# Altium schematic sheet [3]Motor.SchDoc
size A3
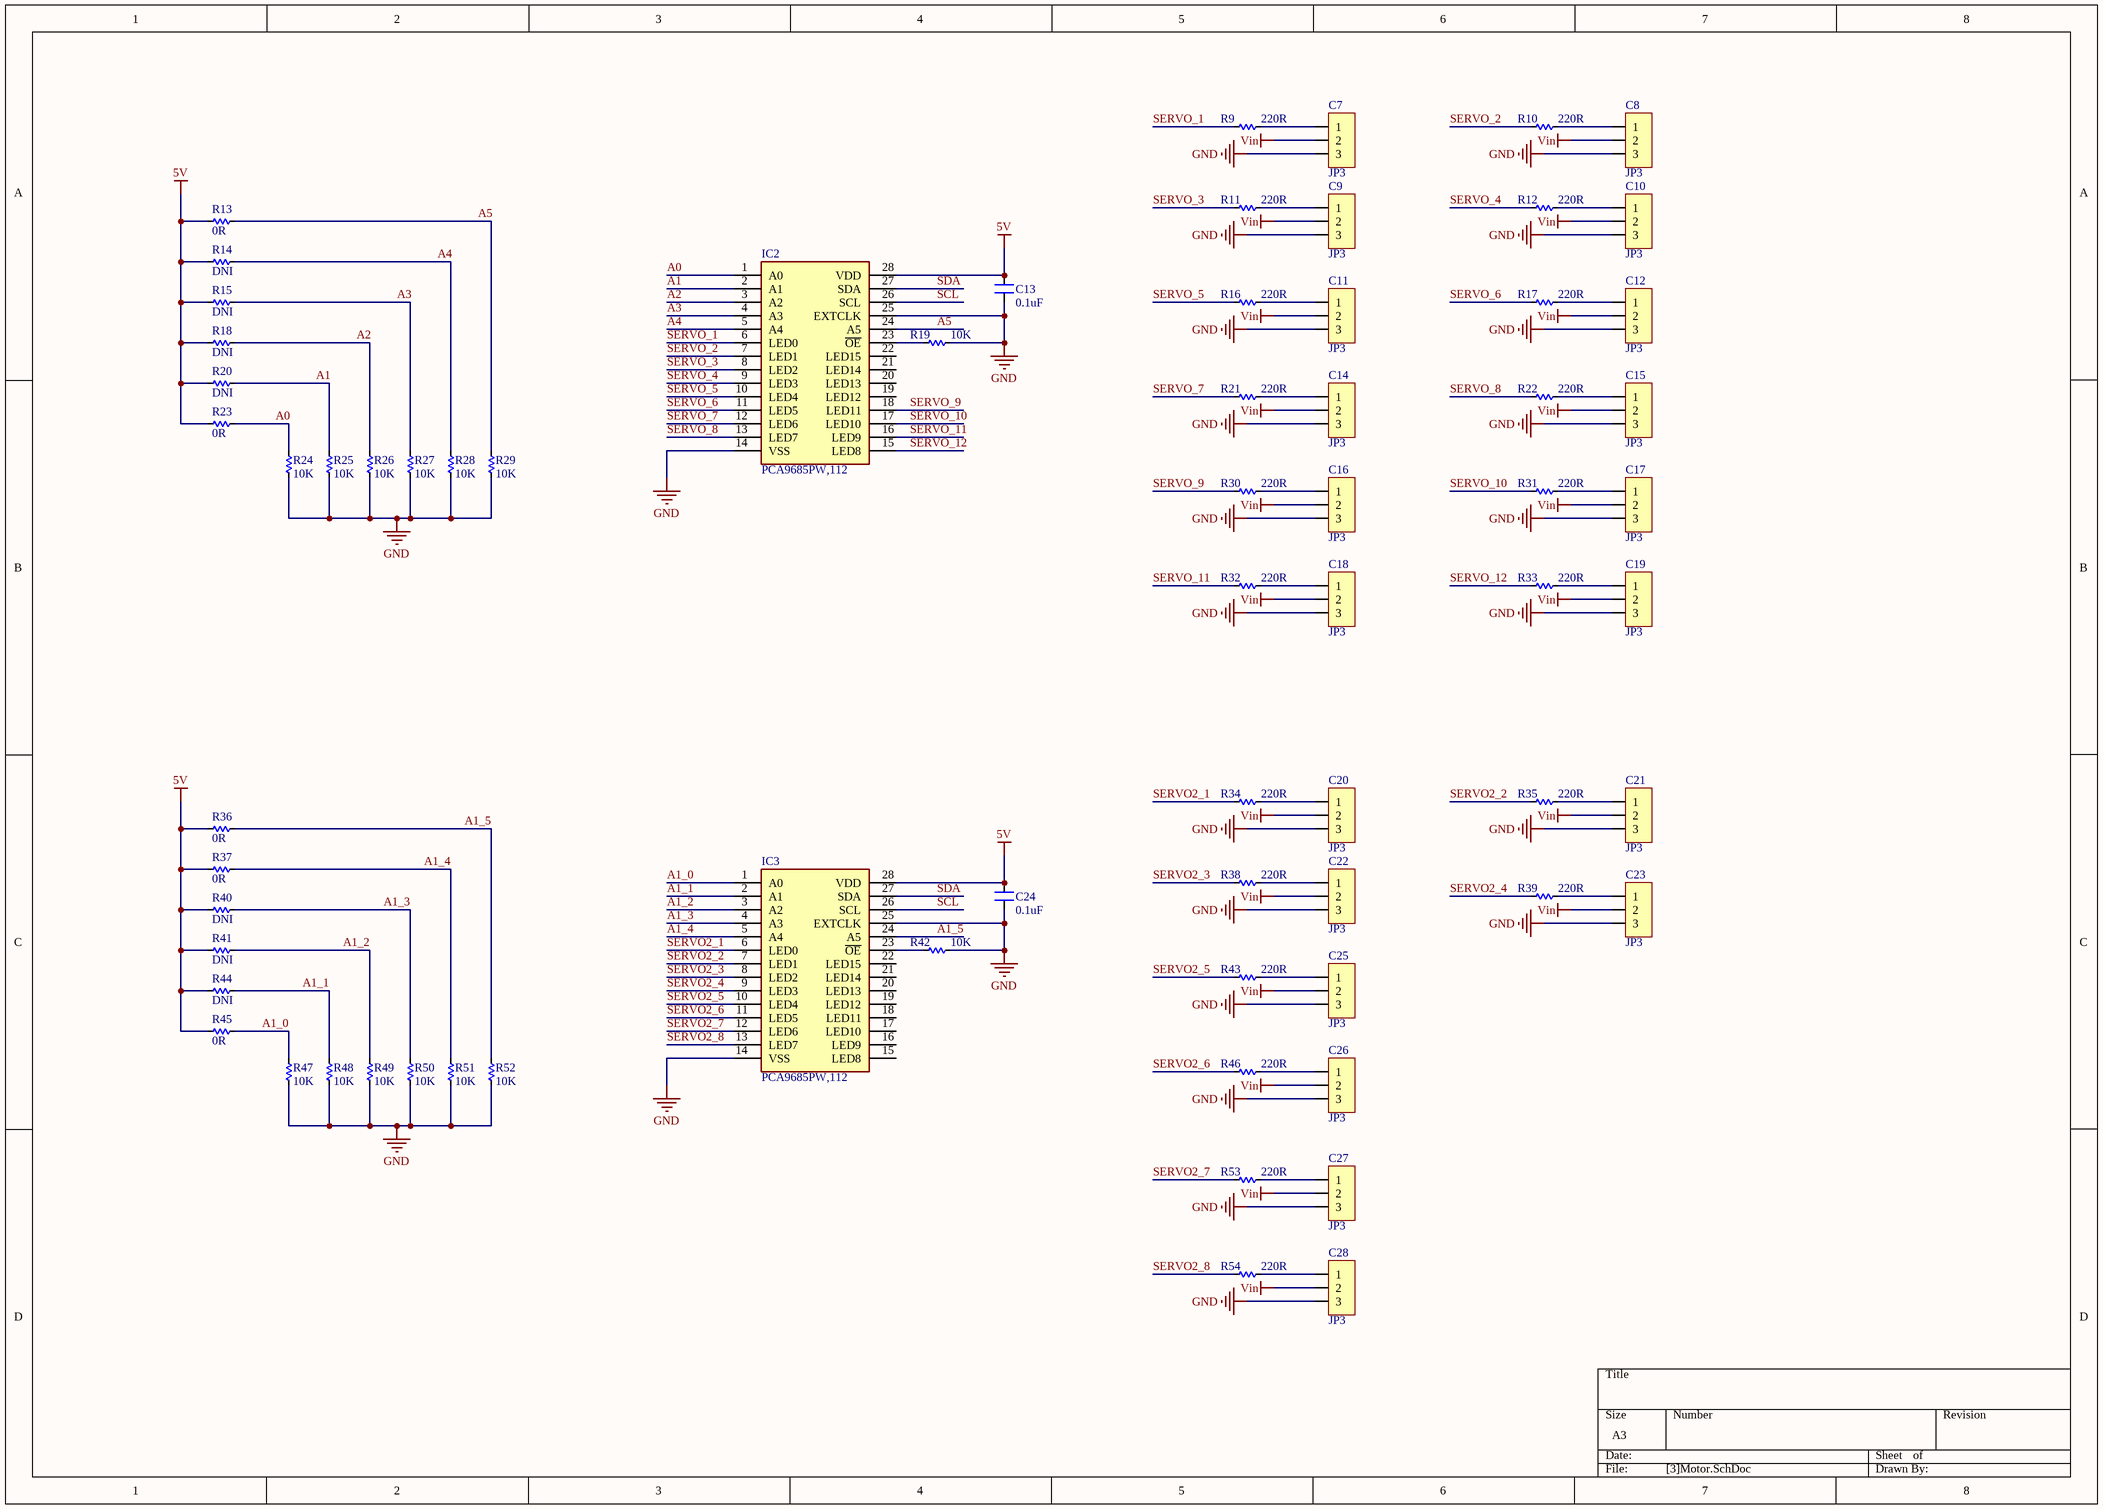
[diagram p0: [3]Motor.SchDoc]

## Parts
C7  JP3  [JP3-D1T]
C8  JP3  [JP3-D1T]
C9  JP3  [JP3-D1T]
C10  JP3  [JP3-D1T]
C11  JP3  [JP3-D1T]
C12  JP3  [JP3-D1T]
C13  0.1uF  [CN-SMD-0603]
C14  JP3  [JP3-D1T]
C15  JP3  [JP3-D1T]
C16  JP3  [JP3-D1T]
C17  JP3  [JP3-D1T]
C18  JP3  [JP3-D1T]
C19  JP3  [JP3-D1T]
C20  JP3  [JP3-D1T]
C21  JP3  [JP3-D1T]
C22  JP3  [JP3-D1T]
C23  JP3  [JP3-D1T]
C24  0.1uF  [CN-SMD-0603]
C25  JP3  [JP3-D1T]
C26  JP3  [JP3-D1T]
C27  JP3  [JP3-D1T]
C28  JP3  [JP3-D1T]
IC2  PCA9685PW,112  [SOP65P640X110-28N]
IC3  PCA9685PW,112  [SOP65P640X110-28N]
R9  220R  [RES-SMD-0603]
R10  220R  [RES-SMD-0603]
R11  220R  [RES-SMD-0603]
R12  220R  [RES-SMD-0603]
R13  0R  [RES-SMD-0603]
R14  DNI  [RES-SMD-0603]
R15  DNI  [RES-SMD-0603]
R16  220R  [RES-SMD-0603]
R17  220R  [RES-SMD-0603]
R18  DNI  [RES-SMD-0603]
R19  10K  [RES-SMD-0603]
R20  DNI  [RES-SMD-0603]
R21  220R  [RES-SMD-0603]
R22  220R  [RES-SMD-0603]
R23  0R  [RES-SMD-0603]
R24  10K  [RES-SMD-0603]
R25  10K  [RES-SMD-0603]
R26  10K  [RES-SMD-0603]
R27  10K  [RES-SMD-0603]
R28  10K  [RES-SMD-0603]
R29  10K  [RES-SMD-0603]
R30  220R  [RES-SMD-0603]
R31  220R  [RES-SMD-0603]
R32  220R  [RES-SMD-0603]
R33  220R  [RES-SMD-0603]
R34  220R  [RES-SMD-0603]
R35  220R  [RES-SMD-0603]
R36  0R  [RES-SMD-0603]
R37  0R  [RES-SMD-0603]
R38  220R  [RES-SMD-0603]
R39  220R  [RES-SMD-0603]
R40  DNI  [RES-SMD-0603]
R41  DNI  [RES-SMD-0603]
R42  10K  [RES-SMD-0603]
R43  220R  [RES-SMD-0603]
R44  DNI  [RES-SMD-0603]
R45  0R  [RES-SMD-0603]
R46  220R  [RES-SMD-0603]
R47  10K  [RES-SMD-0603]
R48  10K  [RES-SMD-0603]
R49  10K  [RES-SMD-0603]
R50  10K  [RES-SMD-0603]
R51  10K  [RES-SMD-0603]
R52  10K  [RES-SMD-0603]
R53  220R  [RES-SMD-0603]
R54  220R  [RES-SMD-0603]

## Nets
5V: C13.2 C24.2 IC2.28(VDD) IC3.28(VDD) R13.2 R14.2 R15.2 R18.2 R20.2 R23.2 R36.2 R37.2 R40.2 R41.2 R44.2 R45.2
GND: C7.3 C8.3 C9.3 C10.3 C11.3 C12.3 C13.1 C14.3 C15.3 C16.3 C17.3 C18.3 C19.3 C20.3 C21.3 C22.3 C23.3 C24.1 C25.3 C26.3 C27.3 C28.3 IC2.14(VSS) IC2.25(EXTCLK) IC3.14(VSS) IC3.25(EXTCLK) R19.2 R24.2 R25.2 R26.2 R27.2 R28.2 R29.2 R42.2 R47.2 R48.2 R49.2 R50.2 R51.2 R52.2
Vin: C7.2 C8.2 C9.2 C10.2 C11.2 C12.2 C14.2 C15.2 C16.2 C17.2 C18.2 C19.2 C20.2 C21.2 C22.2 C23.2 C25.2 C26.2 C27.2 C28.2
A0: IC2.1(A0) R23.1 R24.1
A1: IC2.2(A1) R20.1 R25.1
A1_0: IC3.1(A0) R45.1 R47.1
A1_1: IC3.2(A1) R44.1 R48.1
A1_2: IC3.3(A2) R41.1 R49.1
A1_3: IC3.4(A3) R40.1 R50.1
A1_4: IC3.5(A4) R37.1 R51.1
A1_5: IC3.24(A5) R36.1 R52.1
A2: IC2.3(A2) R18.1 R26.1
A3: IC2.4(A3) R15.1 R27.1
A4: IC2.5(A4) R14.1 R28.1
A5: IC2.24(A5) R13.1 R29.1
SCL: IC2.26(SCL) IC3.26(SCL)
SDA: IC2.27(SDA) IC3.27(SDA)
SERVO2_1: IC3.6(LED0) R34.1
SERVO2_2: IC3.7(LED1) R35.1
SERVO2_3: IC3.8(LED2) R38.1
SERVO2_4: IC3.9(LED3) R39.1
SERVO2_5: IC3.10(LED4) R43.1
SERVO2_6: IC3.11(LED5) R46.1
SERVO2_7: IC3.12(LED6) R53.1
SERVO2_8: IC3.13(LED7) R54.1
SERVO_1: IC2.6(LED0) R9.1
SERVO_2: IC2.7(LED1) R10.1
SERVO_3: IC2.8(LED2) R11.1
SERVO_4: IC2.9(LED3) R12.1
SERVO_5: IC2.10(LED4) R16.1
SERVO_6: IC2.11(LED5) R17.1
SERVO_7: IC2.12(LED6) R21.1
SERVO_8: IC2.13(LED7) R22.1
SERVO_9: IC2.18(LED11) R30.1
SERVO_10: IC2.17(LED10) R31.1
SERVO_11: IC2.16(LED9) R32.1
SERVO_12: IC2.15(LED8) R33.1
NetC7_1: C7.1 R9.2
NetC8_1: C8.1 R10.2
NetC9_1: C9.1 R11.2
NetC10_1: C10.1 R12.2
NetC11_1: C11.1 R16.2
NetC12_1: C12.1 R17.2
NetC14_1: C14.1 R21.2
NetC15_1: C15.1 R22.2
NetC16_1: C16.1 R30.2
NetC17_1: C17.1 R31.2
NetC18_1: C18.1 R32.2
NetC19_1: C19.1 R33.2
NetC20_1: C20.1 R34.2
NetC21_1: C21.1 R35.2
NetC22_1: C22.1 R38.2
NetC23_1: C23.1 R39.2
NetC25_1: C25.1 R43.2
NetC26_1: C26.1 R46.2
NetC27_1: C27.1 R53.2
NetC28_1: C28.1 R54.2
NetIC2_23: IC2.23(~{OE}) R19.1
NetIC3_23: IC3.23(~{OE}) R42.1

Not connected (* = marked no-connect by the designer): IC2 19(LED12) 20(LED13) 21(LED14) 22(LED15); IC3 15(LED8) 16(LED9) 17(LED10) 18(LED11) 19(LED12) 20(LED13) 21(LED14) 22(LED15)

## Library data of the parts
C7-C12 C14-C23 C25-C28 = JP3: WR-PHD 2.54 mm Angled Socket Header; Manufacturer: W¨¹rth Elektronik eiSos GmbH; partNo: 613003143121; ComponentLink1 Description: Manufacturer; ComponentLink2 Description: Datasheet; NoPins: 03; Created Date: 29 March 2013; ComponentLink1URL: http://www.we-online.com; ComponentLink2URL: http://katalog.we-online.de/em/datasheet/6130xx143121.pdf; Created by: Karrer Zheng
C13 C24 = CN: Tu gom; Value: 33pF
IC2 IC3 = PCA9685PW,112: Integrated Circuit; Manufacturer_Name: NXP; Datasheet Link: http://www.nxp.com/docs/en/data-sheet/PCA9685.pdf; Height: 1.1mm; Manufacturer_Part_Number: PCA9685PW,112; Mouser Part Number: 771-PCA9685PW,112; Mouser Price/Stock: https://www.mouser.co.uk/ProductDetail/NXP-Semiconductors/PCA9685PW112?qs=6YAT8rHPFU9wZqiAeiOMZw%3D%3D; Arrow Part Number: PCA9685PW,112; Arrow Price/Stock: https://www.arrow.com/en/products/pca9685pw112/nxp-semiconductors?region=nac
R9-R54 = Res-SMD: Resistor; Manufacturer: Generic Components; Class: Passive; Published: 08/06/2000; Publisher: Altium Hobart Technology Centre